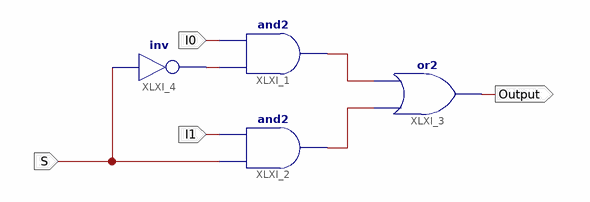
[diagram p0: schematic sheet 1]
// Xilinx ISE schematic MUX2_1.sch (virtex6) as structural Verilog: 4 symbols, 4 ports
module MUX2_1 (
  input  I0,
  input  I1,
  input  S,
  output Output
);

  wire XLXN_1, XLXN_2, XLXN_7;

  and XLXI_1 (XLXN_1, XLXN_7, I0);
  and XLXI_2 (XLXN_2, S, I1);
  or XLXI_3 (Output, XLXN_2, XLXN_1);
  not XLXI_4 (XLXN_7, S);
endmodule
